# Altium schematic sheet NetTie15VAndDiff.SchDoc
size A4; CompanyName: Technische Hochschule Nürnberg Georg Simon Ohm; Address1: Fürther Straße 250; Address2: 90429 Nürnberg; Address3: GERMANY; SheetNumber: 13; SheetTotal: 21; CompanyName2: Institut ELSYS
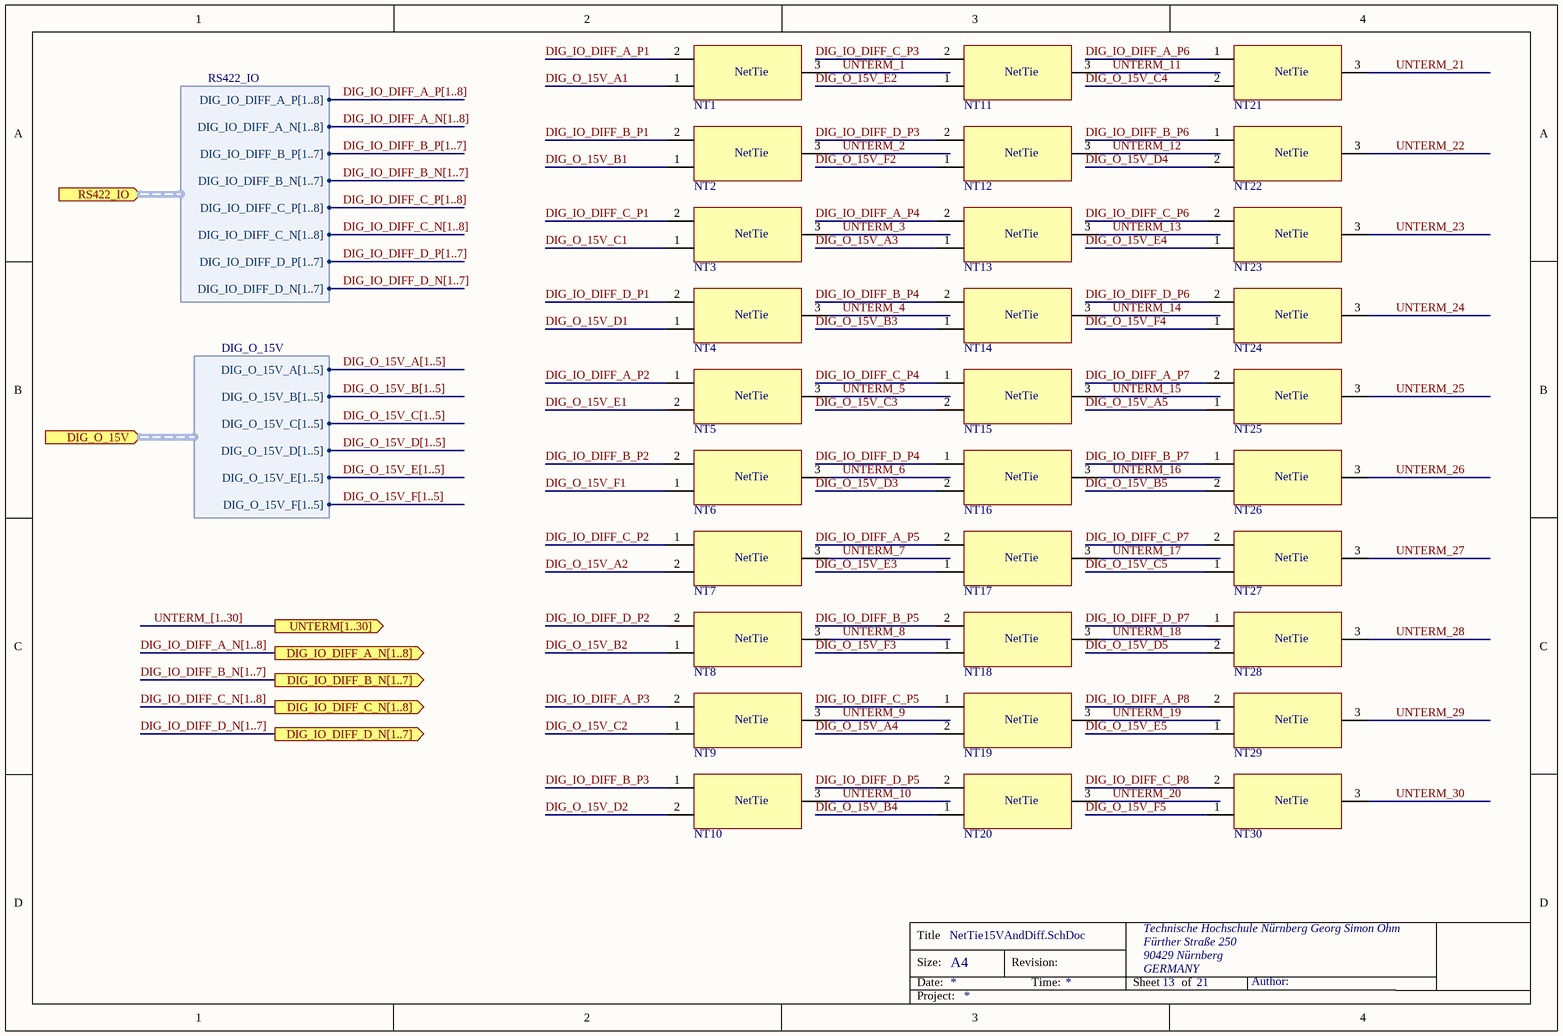
[diagram p0: NetTie15VAndDiff.SchDoc]

## Parts
NT1  NetTie_2_to_1  [2_to_1_NETTIE_TH]  (value not drawn)  (net tie, no BOM)
NT2  NetTie_2_to_1  [2_to_1_NETTIE_TH]  (value not drawn)  (net tie, no BOM)
NT3  NetTie_2_to_1  [2_to_1_NETTIE_TH]  (value not drawn)  (net tie, no BOM)
NT4  NetTie_2_to_1  [2_to_1_NETTIE_TH]  (value not drawn)  (net tie, no BOM)
NT5  NetTie_2_to_1  [2_to_1_NETTIE_TH]  (value not drawn)  (net tie, no BOM)
NT6  NetTie_2_to_1  [2_to_1_NETTIE_TH]  (value not drawn)  (net tie, no BOM)
NT7  NetTie_2_to_1  [2_to_1_NETTIE_TH]  (value not drawn)  (net tie, no BOM)
NT8  NetTie_2_to_1  [2_to_1_NETTIE_TH]  (value not drawn)  (net tie, no BOM)
NT9  NetTie_2_to_1  [2_to_1_NETTIE_TH]  (value not drawn)  (net tie, no BOM)
NT10  NetTie_2_to_1  [2_to_1_NETTIE_TH]  (value not drawn)  (net tie, no BOM)
NT11  NetTie_2_to_1  [2_to_1_NETTIE_TH]  (value not drawn)  (net tie, no BOM)
NT12  NetTie_2_to_1  [2_to_1_NETTIE_TH]  (value not drawn)  (net tie, no BOM)
NT13  NetTie_2_to_1  [2_to_1_NETTIE_TH]  (value not drawn)  (net tie, no BOM)
NT14  NetTie_2_to_1  [2_to_1_NETTIE_TH]  (value not drawn)  (net tie, no BOM)
NT15  NetTie_2_to_1  [2_to_1_NETTIE_TH]  (value not drawn)  (net tie, no BOM)
NT16  NetTie_2_to_1  [2_to_1_NETTIE_TH]  (value not drawn)  (net tie, no BOM)
NT17  NetTie_2_to_1  [2_to_1_NETTIE_TH]  (value not drawn)  (net tie, no BOM)
NT18  NetTie_2_to_1  [2_to_1_NETTIE_TH]  (value not drawn)  (net tie, no BOM)
NT19  NetTie_2_to_1  [2_to_1_NETTIE_TH]  (value not drawn)  (net tie, no BOM)
NT20  NetTie_2_to_1  [2_to_1_NETTIE_TH]  (value not drawn)  (net tie, no BOM)
NT21  NetTie_2_to_1  [2_to_1_NETTIE_TH]  (value not drawn)  (net tie, no BOM)
NT22  NetTie_2_to_1  [2_to_1_NETTIE_TH]  (value not drawn)  (net tie, no BOM)
NT23  NetTie_2_to_1  [2_to_1_NETTIE_TH]  (value not drawn)  (net tie, no BOM)
NT24  NetTie_2_to_1  [2_to_1_NETTIE_TH]  (value not drawn)  (net tie, no BOM)
NT25  NetTie_2_to_1  [2_to_1_NETTIE_TH]  (value not drawn)  (net tie, no BOM)
NT26  NetTie_2_to_1  [2_to_1_NETTIE_TH]  (value not drawn)  (net tie, no BOM)
NT27  NetTie_2_to_1  [2_to_1_NETTIE_TH]  (value not drawn)  (net tie, no BOM)
NT28  NetTie_2_to_1  [2_to_1_NETTIE_TH]  (value not drawn)  (net tie, no BOM)
NT29  NetTie_2_to_1  [2_to_1_NETTIE_TH]  (value not drawn)  (net tie, no BOM)
NT30  NetTie_2_to_1  [2_to_1_NETTIE_TH]  (value not drawn)  (net tie, no BOM)

## Ports
DIG_IO_DIFF_A_N[1..8] (out), DIG_IO_DIFF_B_N[1..7] (out), DIG_IO_DIFF_C_N[1..8] (out), DIG_IO_DIFF_D_N[1..7] (out), DIG_O_15V (in, harness DIG_O_15V), RS422_IO (in, harness RS422_IO), UNTERM[1..30] (out)

## Harnesses
RS422_IO: DIG_IO_DIFF_A_N[1..8], DIG_IO_DIFF_A_P[1..8], DIG_IO_DIFF_B_N[1..7], DIG_IO_DIFF_B_P[1..7], DIG_IO_DIFF_C_N[1..8], DIG_IO_DIFF_C_P[1..8], DIG_IO_DIFF_D_N[1..7], DIG_IO_DIFF_D_P[1..7]
DIG_O_15V: DIG_O_15V_A[1..5], DIG_O_15V_B[1..5], DIG_O_15V_C[1..5], DIG_O_15V_D[1..5], DIG_O_15V_E[1..5], DIG_O_15V_F[1..5]

## Nets
DIG_IO_DIFF_A_P1: NT1.2
DIG_IO_DIFF_A_P2: NT5.1
DIG_IO_DIFF_A_P3: NT9.2
DIG_IO_DIFF_A_P4: NT13.2
DIG_IO_DIFF_A_P5: NT17.2
DIG_IO_DIFF_A_P6: NT21.1
DIG_IO_DIFF_A_P7: NT25.2
DIG_IO_DIFF_A_P8: NT29.2
DIG_IO_DIFF_B_P1: NT2.2
DIG_IO_DIFF_B_P2: NT6.2
DIG_IO_DIFF_B_P3: NT10.1
DIG_IO_DIFF_B_P4: NT14.2
DIG_IO_DIFF_B_P5: NT18.2
DIG_IO_DIFF_B_P6: NT22.1
DIG_IO_DIFF_B_P7: NT26.1
DIG_IO_DIFF_C_P1: NT3.2
DIG_IO_DIFF_C_P2: NT7.1
DIG_IO_DIFF_C_P3: NT11.2
DIG_IO_DIFF_C_P4: NT15.1
DIG_IO_DIFF_C_P5: NT19.1
DIG_IO_DIFF_C_P6: NT23.2
DIG_IO_DIFF_C_P7: NT27.2
DIG_IO_DIFF_C_P8: NT30.2
DIG_IO_DIFF_D_P1: NT4.2
DIG_IO_DIFF_D_P2: NT8.2
DIG_IO_DIFF_D_P3: NT12.2
DIG_IO_DIFF_D_P4: NT16.1
DIG_IO_DIFF_D_P5: NT20.2
DIG_IO_DIFF_D_P6: NT24.2
DIG_IO_DIFF_D_P7: NT28.1
DIG_O_15V_A1: NT1.1
DIG_O_15V_A2: NT7.2
DIG_O_15V_A3: NT13.1
DIG_O_15V_A4: NT19.2
DIG_O_15V_A5: NT25.1
DIG_O_15V_B1: NT2.1
DIG_O_15V_B2: NT8.1
DIG_O_15V_B3: NT14.1
DIG_O_15V_B4: NT20.1
DIG_O_15V_B5: NT26.2
DIG_O_15V_C1: NT3.1
DIG_O_15V_C2: NT9.1
DIG_O_15V_C3: NT15.2
DIG_O_15V_C4: NT21.2
DIG_O_15V_C5: NT27.1
DIG_O_15V_D1: NT4.1
DIG_O_15V_D2: NT10.2
DIG_O_15V_D3: NT16.2
DIG_O_15V_D4: NT22.2
DIG_O_15V_D5: NT28.2
DIG_O_15V_E1: NT5.2
DIG_O_15V_E2: NT11.1
DIG_O_15V_E3: NT17.1
DIG_O_15V_E4: NT23.1
DIG_O_15V_E5: NT29.1
DIG_O_15V_F1: NT6.1
DIG_O_15V_F2: NT12.1
DIG_O_15V_F3: NT18.1
DIG_O_15V_F4: NT24.1
DIG_O_15V_F5: NT30.1
UNTERM_1: NT1.3
UNTERM_2: NT2.3
UNTERM_3: NT3.3
UNTERM_4: NT4.3
UNTERM_5: NT5.3
UNTERM_6: NT6.3
UNTERM_7: NT7.3
UNTERM_8: NT8.3
UNTERM_9: NT9.3
UNTERM_10: NT10.3
UNTERM_11: NT11.3
UNTERM_12: NT12.3
UNTERM_13: NT13.3
UNTERM_14: NT14.3
UNTERM_15: NT15.3
UNTERM_16: NT16.3
UNTERM_17: NT17.3
UNTERM_18: NT18.3
UNTERM_19: NT19.3
UNTERM_20: NT20.3
UNTERM_21: NT21.3
UNTERM_22: NT22.3
UNTERM_23: NT23.3
UNTERM_24: NT24.3
UNTERM_25: NT25.3
UNTERM_26: NT26.3
UNTERM_27: NT27.3
UNTERM_28: NT28.3
UNTERM_29: NT29.3
UNTERM_30: NT30.3

## Buses and harness runs
bus DIG_IO_DIFF_A_N[1..8]
bus DIG_IO_DIFF_A_N[1..8] = port DIG_IO_DIFF_A_N[1..8]
bus DIG_IO_DIFF_A_P[1..8]
bus DIG_IO_DIFF_B_N[1..7]
bus DIG_IO_DIFF_B_N[1..7] = port DIG_IO_DIFF_B_N[1..7]
bus DIG_IO_DIFF_B_P[1..7]
bus DIG_IO_DIFF_C_N[1..8]
bus DIG_IO_DIFF_C_N[1..8] = port DIG_IO_DIFF_C_N[1..8]
bus DIG_IO_DIFF_C_P[1..8]
bus DIG_IO_DIFF_D_N[1..7]
bus DIG_IO_DIFF_D_N[1..7] = port DIG_IO_DIFF_D_N[1..7]
bus DIG_IO_DIFF_D_P[1..7]
bus DIG_O_15V_A[1..5]
bus DIG_O_15V_B[1..5]
bus DIG_O_15V_C[1..5]
bus DIG_O_15V_D[1..5]
bus DIG_O_15V_E[1..5]
bus DIG_O_15V_F[1..5]
bus UNTERM_[1..30] = port UNTERM[1..30]

## Notes on the sheet
- Title
- Size:
- Date:
- A4
- Revision:
- Time:
- Sheet
- of
- Author:
- Project:
- (in symbol NetTie_2_to_1) NetTie

## Library data of the parts
NT1-NT30 = NetTie_2_to_1: Created: 2020-01-03_Thilo_Wendt